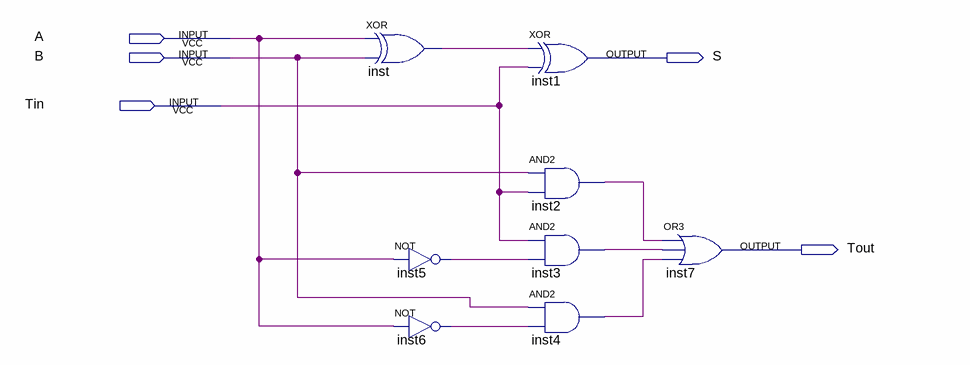
[diagram p0: schematic sheet]
// Quartus schematic Subtrator1bit.bdf as structural Verilog: 8 symbols, 5 pins
module Subtrator1bit (
  input  A,
  input  B,
  input  Tin,
  output S,
  output Tout
);

  wire inst2_out, inst3_out, inst4_out, inst5_out, inst6_out, inst_out;

  xor inst (inst_out, A, B);
  not inst5 (inst5_out, A);
  not inst6 (inst6_out, A);
  xor inst1 (S, inst_out, Tin);
  and inst2 (inst2_out, B, Tin);
  and inst3 (inst3_out, Tin, inst5_out);
  and inst4 (inst4_out, B, inst6_out);
  or inst7 (Tout, inst2_out, inst3_out, inst4_out);
endmodule
